# Altium schematic sheet Sheet3.SchDoc
size A4; SheetNumber: 1; SheetTotal: 3
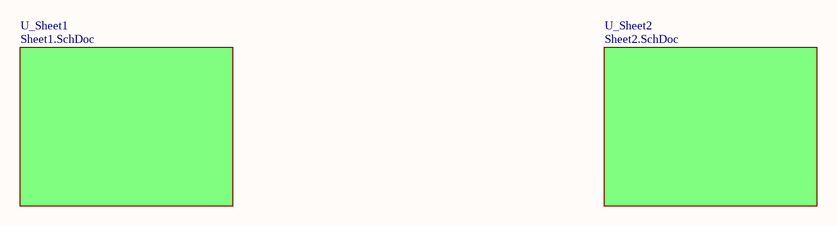
[diagram p0: Sheet3.SchDoc]

## Sub-sheets
U_Sheet1 = Sheet1.SchDoc: no entries
U_Sheet2 = Sheet2.SchDoc: no entries